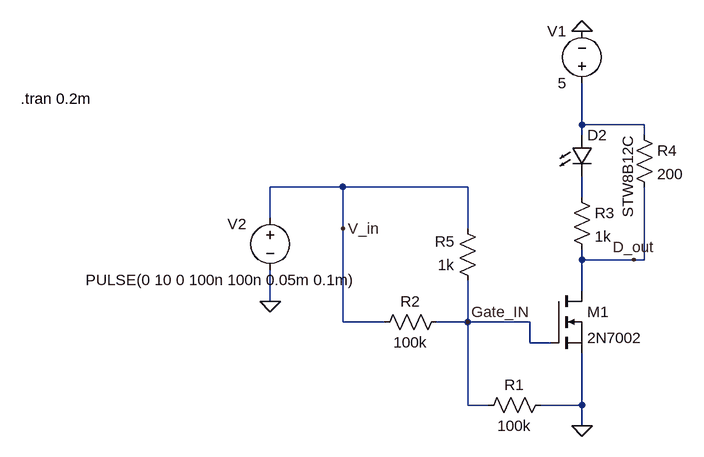
[diagram p0: schematic 4_CMOS_driver.asc]
4_CMOS_driver.asc, the LTspice schematic file:
Version 4
SHEET 1 880 680
WIRE -48 -368 -48 -432
WIRE 48 -368 -48 -368
WIRE -48 -352 -48 -368
WIRE 48 -352 48 -368
WIRE -416 -272 -528 -272
WIRE -224 -272 -416 -272
WIRE -48 -256 -48 -288
WIRE -528 -224 -528 -272
WIRE -416 -208 -416 -272
WIRE -224 -208 -224 -272
WIRE -48 -160 -48 -176
WIRE 32 -160 -48 -160
WIRE 48 -160 48 -272
WIRE 48 -160 32 -160
WIRE -48 -112 -48 -160
WIRE -528 -96 -528 -144
WIRE -416 -64 -416 -208
WIRE -352 -64 -416 -64
WIRE -224 -64 -224 -128
WIRE -224 -64 -272 -64
WIRE -128 -64 -224 -64
WIRE -128 -32 -128 -64
WIRE -96 -32 -128 -32
WIRE -224 64 -224 -64
WIRE -192 64 -224 64
WIRE -48 64 -48 -16
WIRE -48 64 -112 64
WIRE -48 96 -48 64
FLAG -48 96 0
FLAG -48 -512 0
FLAG -528 -96 0
FLAG 32 -160 D_out
FLAG -224 -64 Gate_IN
FLAG -416 -208 V_in
SYMBOL res -96 48 R90
WINDOW 0 0 56 VBottom 2
WINDOW 3 32 56 VTop 2
SYMATTR InstName R1
SYMATTR Value 100k
SYMATTR SpiceLine tol=1
SYMBOL res -368 -48 R270
WINDOW 0 32 56 VTop 2
WINDOW 3 0 56 VBottom 2
SYMATTR InstName R2
SYMATTR Value 100k
SYMATTR SpiceLine tol=1
SYMBOL res -64 -272 R0
SYMATTR InstName R3
SYMATTR Value 1k
SYMATTR SpiceLine tol=1%
SYMBOL res 32 -368 R0
SYMATTR InstName R4
SYMATTR Value 200
SYMATTR SpiceLine tol=1 pwr=0.5
SYMBOL res -208 -112 R180
WINDOW 0 36 76 Left 2
WINDOW 3 36 40 Left 2
SYMATTR InstName R5
SYMATTR Value 1k
SYMATTR SpiceLine tol=1
SYMBOL voltage -48 -416 R180
WINDOW 0 24 96 Left 2
WINDOW 3 24 16 Left 2
WINDOW 123 0 0 Left 2
WINDOW 39 0 0 Left 2
SYMATTR InstName V1
SYMATTR Value 5
SYMBOL voltage -528 -240 R0
WINDOW 123 0 0 Left 2
WINDOW 39 0 0 Left 2
WINDOW 0 -66 25 Left 2
WINDOW 3 -284 111 Left 2
SYMATTR InstName V2
SYMATTR Value PULSE(0 10 0 100n 100n 0.05m 0.1m)
SYMBOL nmos -96 -112 R0
SYMATTR InstName M1
SYMATTR Value 2N7002
SYMBOL LED -64 -352 R0
WINDOW 3 87 1 VRight 2
SYMATTR InstName D2
SYMATTR Value STW8B12C
TEXT -912 -408 Left 2 !.tran 0.2m

The netlist it stands for:
* 4_CMOS_driver.asc
R1 0 Gate_IN 100k tol=1
R2 V_in Gate_IN 100k tol=1
R3 N002 D_out 1k tol=1%
R4 N001 D_out 200 tol=1 pwr=0.5
R5 Gate_IN V_in 1k tol=1
V1 N001 0 5
V2 V_in 0 PULSE(0 10 0 100n 100n 0.05m 0.1m)
M1 D_out Gate_IN 0 0 2N7002
D2 N001 N002 STW8B12C
.model D D
.lib standard.dio
.model NMOS NMOS
.model PMOS PMOS
.lib standard.mos
.tran 0.2m
.backanno
.end